# EAGLE design NRF24-RPi (EAGLE 5.11)
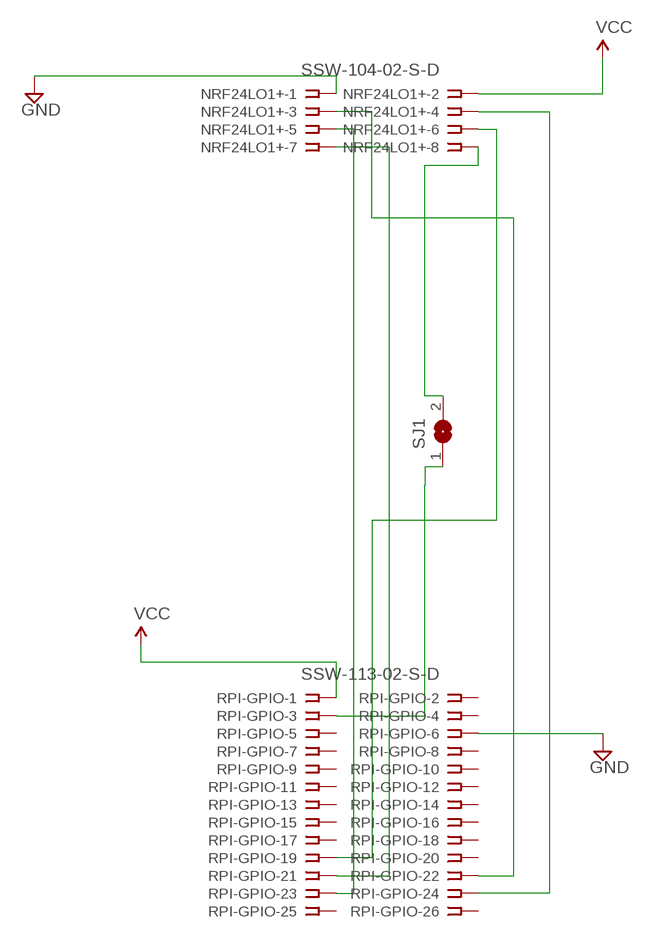
[diagram p0: schematic, sheet 1]

## Parts
NRF24LO1+  SSW-104-02-S-D  [SSW-104-02-S-D]
RPI-GPIO  SSW-113-02-S-D  [SSW-113-02-S-D]
SJ1  SJ  [SJ]

## Nets
GND: NRF24LO1+.1 RPI-GPIO.6
N$1: RPI-GPIO.3 SJ1.1
N$2: NRF24LO1+.3 RPI-GPIO.22
N$3: NRF24LO1+.4 RPI-GPIO.24
N$4: NRF24LO1+.5 RPI-GPIO.23
N$5: NRF24LO1+.6 RPI-GPIO.19
N$6: NRF24LO1+.7 RPI-GPIO.21
N$9: NRF24LO1+.8 SJ1.2
VCC: NRF24LO1+.2 RPI-GPIO.1
Unconnected: RPI-GPIO.2 RPI-GPIO.4 RPI-GPIO.5 RPI-GPIO.7 RPI-GPIO.8 RPI-GPIO.9 RPI-GPIO.10 RPI-GPIO.11 RPI-GPIO.12 RPI-GPIO.13 RPI-GPIO.14 RPI-GPIO.15 RPI-GPIO.16 RPI-GPIO.17 RPI-GPIO.18 RPI-GPIO.20 RPI-GPIO.25 RPI-GPIO.26

## Library data of the parts
NRF24LO1+ = con-samtec:SSW-104-02-S-D: THROUGH-HOLE .025" SQ POST SOCKET Source: Samtec SSW.pdf; MPN: SSW-104-02-S-D; OC_FARNELL: 1668346; OC_NEWARK: 11P9382
RPI-GPIO = con-samtec:SSW-113-02-S-D: THROUGH-HOLE .025" SQ POST SOCKET Source: Samtec SSW.pdf; MPN: SSW-113-02-S-D; OC_FARNELL: unknown; OC_NEWARK: 11P9530
SJ1 = jumper:SJ: SMD solder JUMPER

## Board
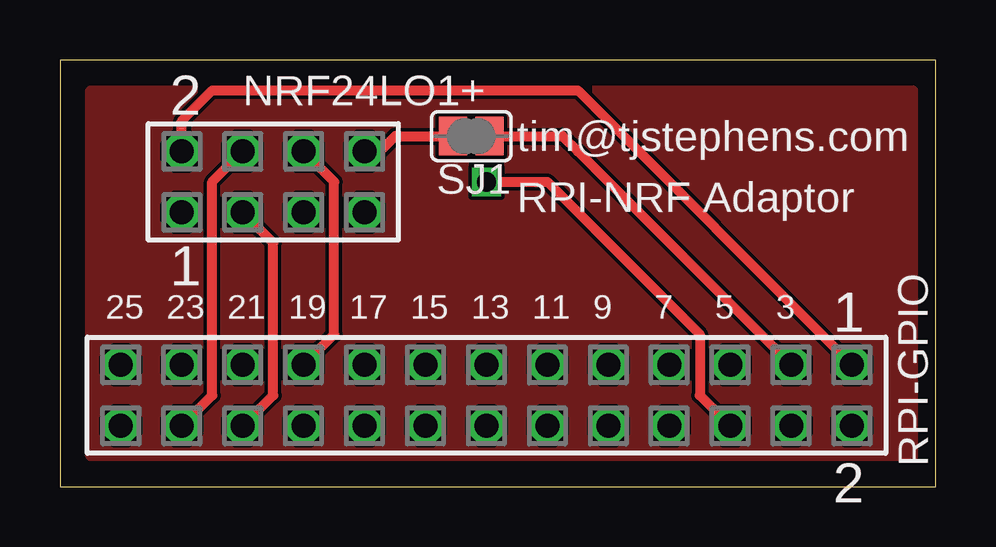
[diagram p1: board, top side]
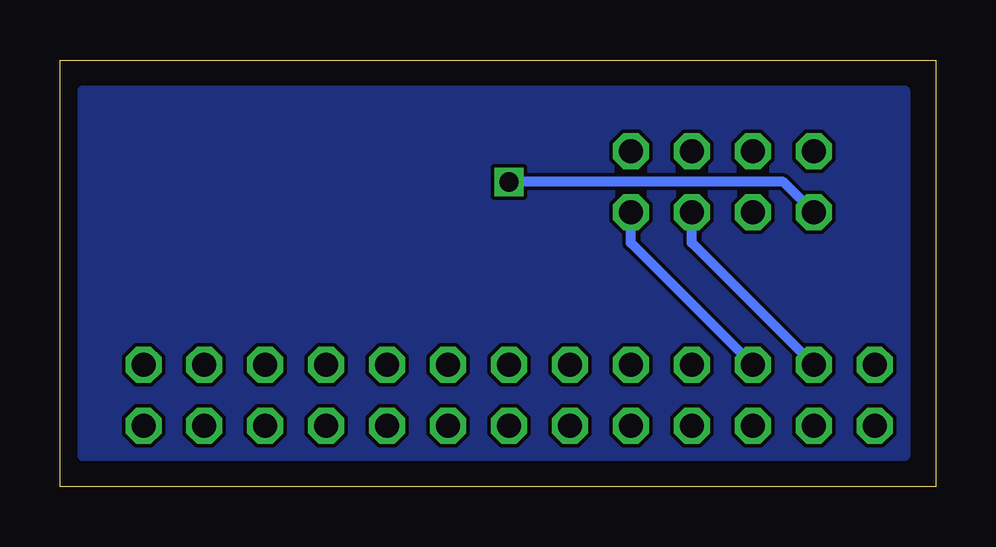
[diagram p2: board, bottom side, seen from below]

Size 36.5 x 17.78 mm. Coordinates in mm from the lower left corner, seen from the top.
Outline: 0,0 36.5,0 36.5,17.77 35.56,17.78 29.21,17.77 0,17.77 0,0
Copper layers (1*16): Top 0.035mm / dielectric 0.2mm / Bottom 0.035mm
Design rules "SeeedStudio_DRU_no_angle_20130527": minimum track width 6mil, minimum drill 12mil, track to track 6mil, track to pad 6mil, pad to pad 6mil, via to via 6mil, smd to smd 0mil, copper to edge 10mil, drill to drill 10mil, minimum pad ring 6mil, minimum via ring 6mil, stop-mask expansion 2mil, vias tented up to drill 25mil, thermal gap 10mil

### Footprints (pad centres in the part's own frame; a part is rotated, then mirrored left to right if it is on the bottom)
SSW-104-02-S-D = drill 1 pad 1.5 octagon: 1 -3.81,-1.27; 2 -3.81,1.27; 3 -1.27,-1.27; 4 -1.27,1.27; 5 1.27,-1.27; 6 1.27,1.27; 7 3.81,-1.27; 8 3.81,1.27
SSW-113-02-S-D = drill 1 pad 1.5 octagon: 1 -15.24,-1.27; 2 -15.24,1.27; 3 -12.7,-1.27; 4 -12.7,1.27; 5 -10.16,-1.27; 6 -10.16,1.27; 7 -7.62,-1.27; 8 -7.62,1.27; 9 -5.08,-1.27; 10 -5.08,1.27; 11 -2.54,-1.27; 12 -2.54,1.27; 13 0,-1.27; 14 0,1.27; 15 2.54,-1.27; 16 2.54,1.27; 17 5.08,-1.27; 18 5.08,1.27; 19 7.62,-1.27; 20 7.62,1.27; 21 10.16,-1.27; 22 10.16,1.27; 23 12.7,-1.27; 24 12.7,1.27; 25 15.24,-1.27; 26 15.24,1.27
SJ = smd 1.168 x 1.6: 1 -0.762,0; 2 0.762,0

### Placement (x,y rotation side)
NRF24LO1+  8.89,12.7 0 top
RPI-GPIO  17.78,3.81 180 top
SJ1  17.14,14.61 180 top

### Tracks (layer width: path | path; a pad name or v marks a point on that pad's centre or on a via)
GND  (via drill 0.8)
  Top 0.406: RPI-GPIO.6 26.67,3.81 26.67,6.35 20.32,12.7 v17.78,12.7
  Bottom 0.406: v17.78,12.7 6.35,12.7 NRF24LO1+.1
N$1
  Top 0.406: RPI-GPIO.3 21.59,13.97 20.95,14.61 SJ1.1
N$2
  Top 0.406: NRF24LO1+.3 8.89,10.16 8.89,3.81 RPI-GPIO.22
N$3
  Top 0.406: NRF24LO1+.4 6.35,12.7 6.35,3.81 RPI-GPIO.24
N$4
  Bottom 0.406: NRF24LO1+.5 10.16,10.16 RPI-GPIO.23
N$5
  Top 0.406: NRF24LO1+.6 11.43,12.7 11.43,6.35 RPI-GPIO.19
N$6
  Bottom 0.406: NRF24LO1+.7 12.7,10.16 RPI-GPIO.21
N$7
  pour Bottom: 1.27,1.27 35.56,1.27 35.56,16.51 1.27,16.51
N$8
  pour Top: 1.27,16.51 35.56,16.51 35.56,1.27 1.27,1.27
N$9
  Top 0.406: NRF24LO1+.8 13.33,13.97 13.97,14.61 SJ1.2
VCC
  Top 0.406: NRF24LO1+.2 5.08,15.24 6.35,16.51 21.59,16.51 RPI-GPIO.1

### Text on the board
tNames: tim@tjstephens.com | RPI-NRF Adaptor | 25 | 23 | 21 | 19 | 17 | 15 | 13 | 11 | 9 | 7 | 5 | 3